# EAGLE schematic tick-box-1591b-mk-1.0 (EAGLE 6.5.0)
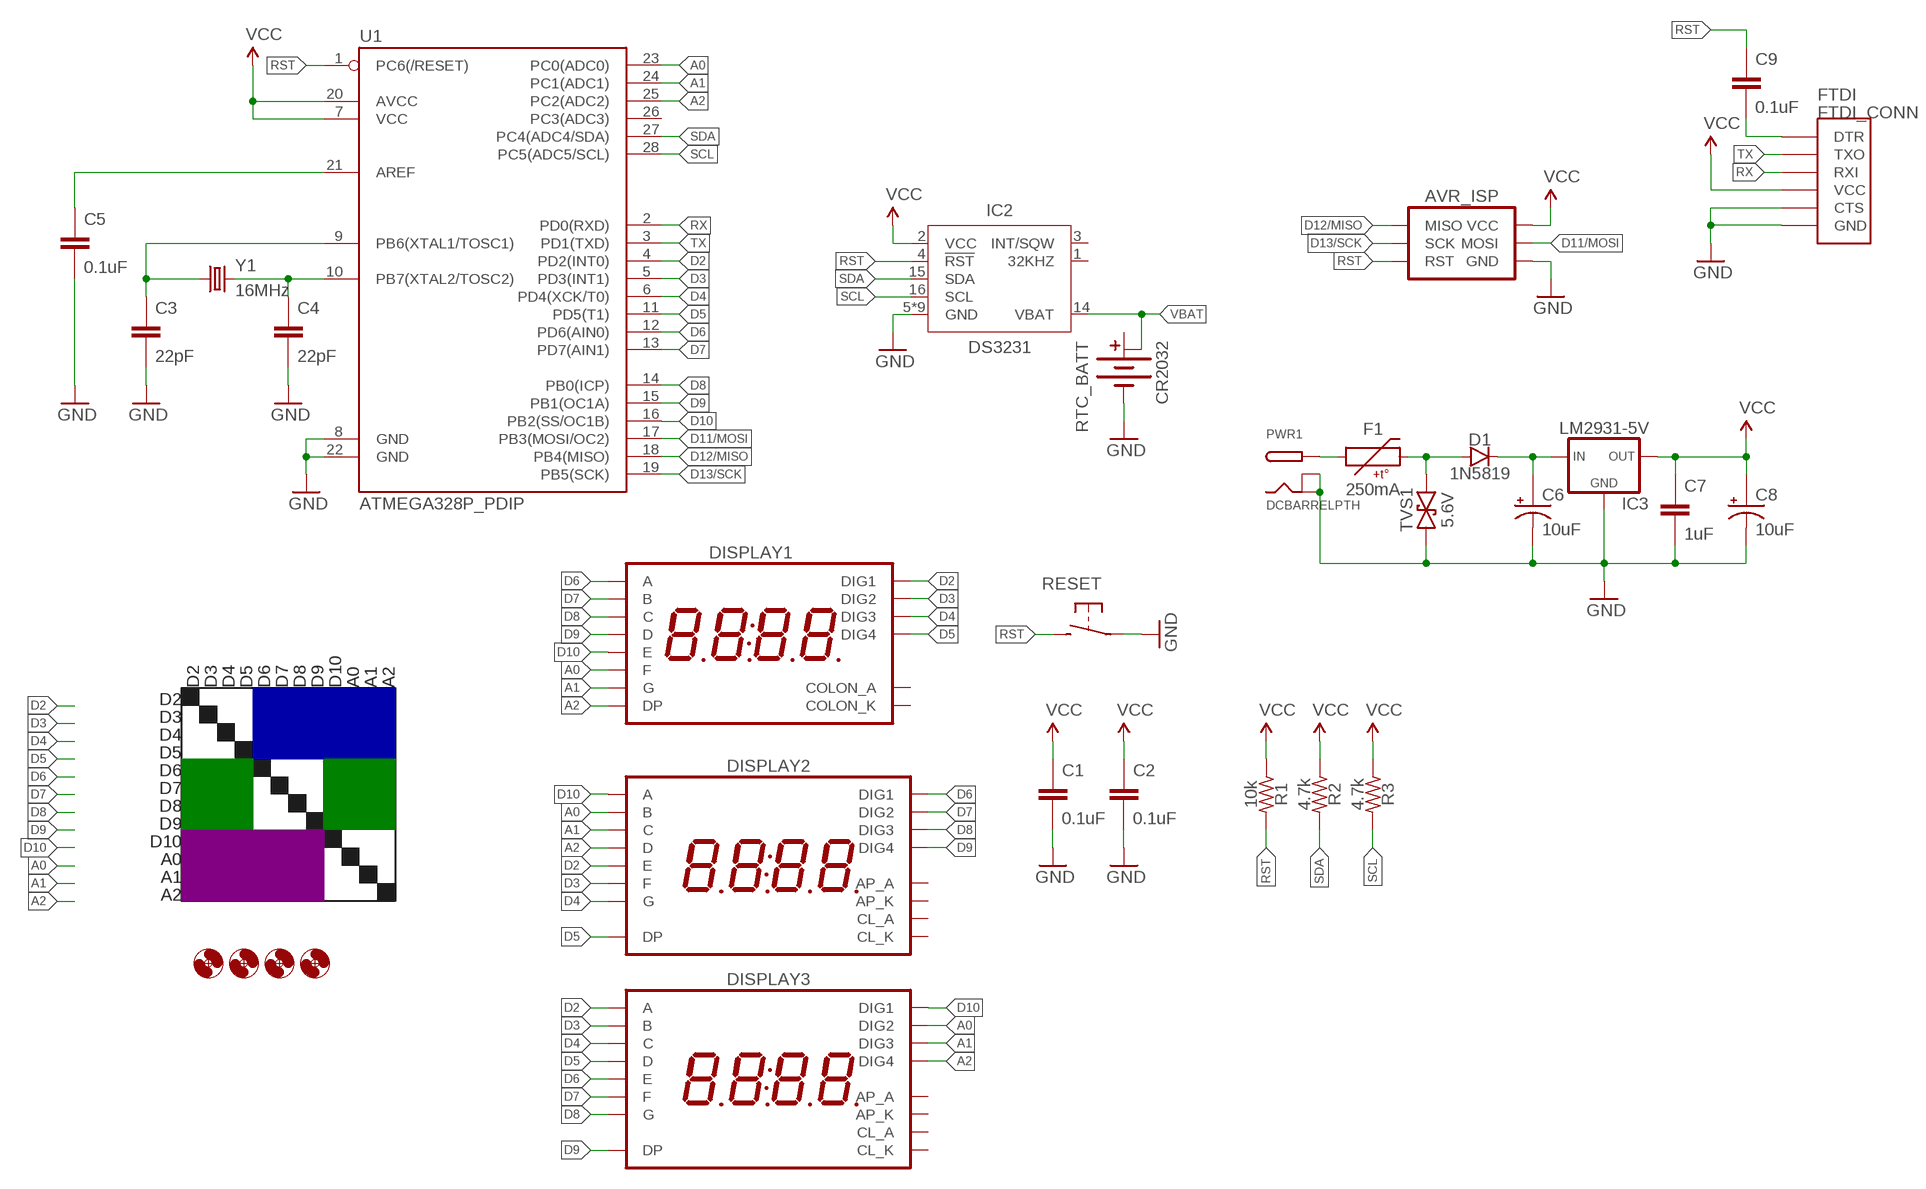
[diagram p0: schematic, sheet 1]

## Parts
AVR_ISP  AVR_SPI_PRG_6PTH  [2X3]
C1  0.1uF  CAPACITOR-CERAMIC025-024X044  [C025-024X044]
C2  0.1uF  CAPACITOR-CERAMIC025-024X044  [C025-024X044]
C3  22pF  CAPACITOR-CERAMIC025-024X044  [C025-024X044]
C4  22pF  CAPACITOR-CERAMIC025-024X044  [C025-024X044]
C5  0.1uF  CAPACITOR-CERAMIC025-024X044  [C025-024X044]
C6  10uF  CAPACITOR-POLARIZEDE2-5  [E2-5]
C7  1uF  CAPACITOR-CERAMIC025-024X044  [C025-024X044]
C8  10uF  CAPACITOR-POLARIZEDE2-5  [E2-5]
C9  0.1uF  CAPACITOR-CERAMIC025-024X044  [C025-024X044]
D1  1N5819  DIODEPTH-10.68MM  [DIODE-10.16MM]
DISPLAY1  7SEG_4DIGIT_COLON14.2MM-CC-NS  [7SEG_4DIG_NS]
DISPLAY2  7SEG_4DIGIT_COLON_APOS  [7SEG_4DIG_10MM]
DISPLAY3  7SEG_4DIGIT_COLON_APOS  [7SEG_4DIG_10MM]
F1  250mA  PTCPTH-5.08MM  [PTC-PTH-5.08MM]
FTDI  FTDI_CONN  [FTDI_CONN]
H1  HOLE#2  [HOLE-#2]
H2  HOLE#2  [HOLE-#2]
H3  HOLE#2  [HOLE-#2]
H4  HOLE#2  [HOLE-#2]
IC2  DS3231  [SO16W]
IC3  LM2931-5V  V_REG_78XXTO-220-THERMPAD  [TO220-IGO-THERMPAD]
PWR1  DCBARRELPTH  [DCJACK_2MM_PTH]
R1  10k  RESISTORPTH-AXIAL-7.62MM  [RESISTOR-AXIAL-PTH-7.62MM]
R2  4.7k  RESISTORPTH-AXIAL-7.62MM  [RESISTOR-AXIAL-PTH-7.62MM]
R3  4.7k  RESISTORPTH-AXIAL-7.62MM  [RESISTOR-AXIAL-PTH-7.62MM]
RESET  SPST-NO-TACT6MM-PTH-SMALL-PADS  [DTS-6-SMALL-PADS]
RTC_BATT  CR2032  BATTERY-COINCR2032_SMD  [BATTCON_20MM_MINE]
TVS1  5.6V  TVSDO-41-TVS-BIDIRECTIONAL  [DO-41-TVS]
U1  ATMEGA328P_PDIP  [DIL28-3]
Y1  16MHz  CRYSTALHC49UV  [HC49U-V]

## Nets
A0: DISPLAY1.P$12(F) DISPLAY2.16(B) DISPLAY3.2(DIG2) U1.23(PC0(ADC0))
A1: DISPLAY1.P$5(G) DISPLAY2.13(C) DISPLAY3.6(DIG3) U1.24(PC1(ADC1))
A2: DISPLAY1.P$3(DP) DISPLAY2.3(D) DISPLAY3.8(DIG4) U1.25(PC2(ADC2))
D2: DISPLAY1.P$14(DIG1) DISPLAY2.5(E) DISPLAY3.14(A) U1.4(PD2(INT0))
D3: DISPLAY1.P$11(DIG2) DISPLAY2.11(F) DISPLAY3.16(B) U1.5(PD3(INT1))
D4: DISPLAY1.P$10(DIG3) DISPLAY2.15(G) DISPLAY3.13(C) U1.6(PD4(XCK/T0))
D5: DISPLAY1.P$6(DIG4) DISPLAY2.7(DP) DISPLAY3.3(D) U1.11(PD5(T1))
D6: DISPLAY1.P$13(A) DISPLAY2.1(DIG1) DISPLAY3.5(E) U1.12(PD6(AIN0))
D7: DISPLAY1.P$9(B) DISPLAY2.2(DIG2) DISPLAY3.11(F) U1.13(PD7(AIN1))
D8: DISPLAY1.P$4(C) DISPLAY2.6(DIG3) DISPLAY3.15(G) U1.14(PB0(ICP))
D9: DISPLAY1.P$2(D) DISPLAY2.8(DIG4) DISPLAY3.7(DP) U1.15(PB1(OC1A))
D10: DISPLAY1.P$1(E) DISPLAY2.14(A) DISPLAY3.1(DIG1) U1.16(PB2(SS/OC1B))
D11/MOSI: AVR_ISP.4(MOSI) U1.17(PB3(MOSI/OC2))
D12/MISO: AVR_ISP.1(MISO) U1.18(PB4(MISO))
D13/SCK: AVR_ISP.3(SCK) U1.19(PB5(SCK))
GND: AVR_ISP.6(GND) C1.2 C2.2 C3.2 C4.2 C5.2 C6.- C7.2 C8.- FTDI.CTS FTDI.GND IC2.5(GND) IC2.6(GND) IC2.7(GND) IC2.8(GND) IC2.9(GND) IC2.10(GND) IC2.11(GND) IC2.12(GND) IC2.13(GND) IC3.4(GND) IC3.GND PWR1.BRK PWR1.GND RESET.1 RESET.2 RTC_BATT.BOTTOM(-) TVS1.P$1 U1.8(GND) U1.22(GND)
N$1: C4.1 U1.10(PB7(XTAL2/TOSC2)) Y1.2
N$2: C3.1 U1.9(PB6(XTAL1/TOSC1)) Y1.1
N$3: C6.+ D1.C IC3.IN
N$4: F1.P$1 PWR1.PWR
N$5: C5.1 U1.21(AREF)
N$6: D1.A F1.P$2 TVS1.P$2
N$9: C9.2 FTDI.DTR
RST: AVR_ISP.5(RST) C9.1 IC2.4(!RST) R1.P$2 RESET.3 RESET.4 U1.1(PC6(/RESET))
RX: FTDI.RXI U1.2(PD0(RXD))
SCL: IC2.16(SCL) R3.P$2 U1.28(PC5(ADC5/SCL))
SDA: IC2.15(SDA) R2.P$2 U1.27(PC4(ADC4/SDA))
TX: FTDI.TXO U1.3(PD1(TXD))
VBAT: IC2.14(VBAT) RTC_BATT.TOP@2(+1)
VCC: AVR_ISP.2(VCC) C1.1 C2.1 C7.1 C8.+ FTDI.VCC IC2.2(VCC) IC3.OUT R1.P$1 R2.P$1 R3.P$1 U1.7(VCC) U1.20(AVCC)
Unconnected: DISPLAY1.P$7(COLON_K) DISPLAY1.P$8(COLON_A) DISPLAY2.4(CL_A) DISPLAY2.9(AP_K) DISPLAY2.10(AP_A) DISPLAY2.12(CL_K) DISPLAY3.4(CL_A) DISPLAY3.9(AP_K) DISPLAY3.10(AP_A) DISPLAY3.12(CL_K) IC2.1(32KHZ) IC2.3(INT/SQW) RTC_BATT.TOP@1(+) U1.26(PC3(ADC3))

## Notes on the sheet
- D2 | D3 | D4 | D5 | D6 | D7 | D8 | D9 | D10 | A0 | A1 | A2
- D2
- D3
- D4
- D5
- D6
- D7
- D8
- D9
- D10
- A0
- A1
- A2

## Library data of the parts
AVR_ISP = A_butts:AVR_SPI_PRG_6: AVR ISP 6 Pin This is the reduced ISP connector for AVR programming. Common on Arduino. This footprint will take up less PCB space and can be used with a 10-pin to 6-pin adapter such as SKU: BOB-08508 **Special note about "TEST_POINT" package. The stop mask is on the top side, so if you want your programming test points to be on the bottom of your board, make sure to place this package on the bottom side of the board. This also ensure that the orientation to program from the bottom side will be correct.
C1-C5 C7 C9 = A_butts:CAPACITOR-CERAMIC: CAPACITOR, European symbol
C6 C8 = A_butts:CAPACITOR-POLARIZED: POLARIZED CAPACITOR, American symbol
D1 = A_butts:DIODE: Diode These are standard reverse protection diodes and small signal diodes. SMA package can handle up to about 1A. SOD-323 can handle about 200mA. What the SOD-323 package when ordering, there are some mfgs out there that are 5-pin packages.
DISPLAY1 = A_butts:7SEG_4DIGIT_COLON
DISPLAY2 DISPLAY3 = A_butts:7SEG_4DIGIT_COLON_APOS
F1 = A_butts:PTC: Resettable Fuse PTC Resettable Fuse. Spark Fun Electronics SKU : COM-08357
FTDI = A_butts:FTDI_CONN: Connector which mates to FTDI basic or FTDI cable.
H1-H4 = A_butts:HOLE: MOUNTING HOLE with drill center marker
IC2 = A_butts:DS3231
IC3 = A_butts:V_REG_78XX: Voltage Regulator Standard 7805 5V regulator. IGO (Input Ground Output). Spark Fun Electronics SKU : COM-00107
PWR1 = A_butts:DCBARREL: 2.0mm DC Barrel Jack DCJACK_2MM_PTH - Through Hole Jack (4UConnector: 05537)
R1-R3 = A_butts:RESISTOR: RESISTOR, American symbol
RESET = A_butts:SPST-NO-TACT
RTC_BATT = A_butts:BATTERY-COIN
TVS1 = A_butts:TVS: Transient voltage suppressor- prevents ESD on inputs. Ignore package description- MBRA140 is NOT this type of part!!!
U1 = A_butts:ATMEGA328P_PDIP: uC used in the Arduino 32kb flash, 1k EEPROM, 2k SRAM This is the through-hole version of this chip.
Y1 = A_butts:CRYSTAL: Various standard crystals. Proven footprints. Spark Fun Electronics SKU : COM-00534